# Altium project QSTL_RFSW_LED.PrjPcb
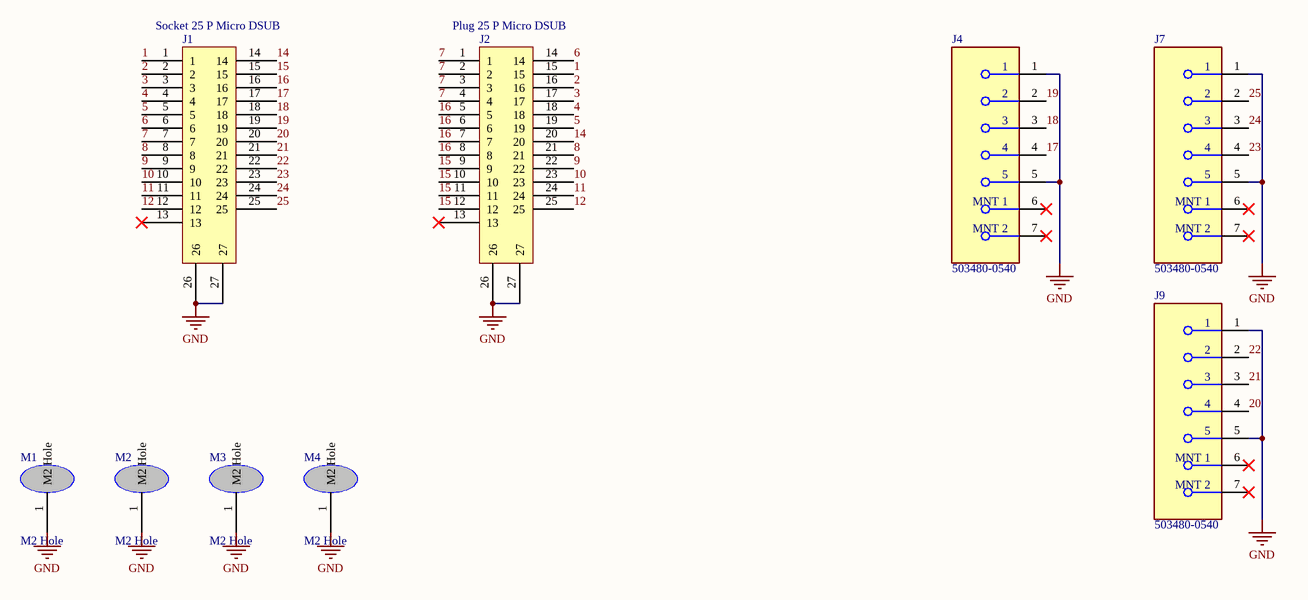
[diagram p0: QSTL_RFSW_LED.SchDoc]
1 sheet, 9 parts. Net scope: global (net labels, ports and power ports of the same name join across sheets).
Board file: QSTL_RFSW_LED.PcbDoc

## Sheet QSTL_RFSW_LED.SchDoc
size A4; SheetNumber: 1; SheetTotal: 1

### Parts
J1  Socket 25 P Micro DSUB  [581-M25-213L461]
J2  Plug 25 P Micro DSUB  [581-M25-113L461]
J4  503480-0540  [FP-503480-0540-MFG]
J7  503480-0540  [FP-503480-0540-MFG]
J9  503480-0540  [FP-503480-0540-MFG]
M1  M2 Hole  [M2_Hole]
M2  M2 Hole  [M2_Hole]
M3  M2 Hole  [M2_Hole]
M4  M2 Hole  [M2_Hole]

### Nets
GND: J1.26 J1.27 J2.26 J2.27 J4.1 J4.5 J7.1 J7.5 J9.1 J9.5 M1.1(M2_Hole) M2.1(M2_Hole) M3.1(M2_Hole) M4.1(M2_Hole)
1: J1.1 J2.15
2: J1.2 J2.16
3: J1.3 J2.17
4: J1.4 J2.18
5: J1.5 J2.19
6: J1.6 J2.14
7: J1.7 J2.1 J2.2 J2.3 J2.4
8: J1.8 J2.21
9: J1.9 J2.22
10: J1.10 J2.23
11: J1.11 J2.24
12: J1.12 J2.25
14: J1.14 J2.20
15: J1.15 J2.9 J2.10 J2.11 J2.12
16: J1.16 J2.5 J2.6 J2.7 J2.8
17: J1.17 J4.4
18: J1.18 J4.3
19: J1.19 J4.2
20: J1.20 J9.4
21: J1.21 J9.3
22: J1.22 J9.2
23: J1.23 J7.4
24: J1.24 J7.3
25: J1.25 J7.2

Not connected (* = marked no-connect by the designer): J1 13*; J2 13*; J4 6(MNT_1)* 7(MNT_2)*; J7 6(MNT_1)* 7(MNT_2)*; J9 6(MNT_1)* 7(MNT_2)*

### Library data of the parts
J1 = 581-M25-213L461
J2 = 581-M25-113L461
J4 J7 J9 = CMP-00257-52963780-1: 503480-0540 Connector FFC/FPC SKT 5 Position 0.5mm Solder Right Angle Surface Mount T/R; Manufacturer Lifecycle Status: ACTIVE; Actuator Material: Glass, Nylon, Polyamide; Number of Positions: 5; Pitch: 508µm; Plating: Gold; Voltage Rating: 50V; Current Rating: 500mA; Wire/Cable Type: Straight; Contact Plating: Gold; Termination: Solder; Country of Origin: KR; Number of Rows: 1; RoHS: Compliant; NexarPartId: 52963780; Max Operating Temperature: 85°C; Lifecycle Status: Production; Mount: Surface Mount; Halogen Free: Low Halogen; Height: 2.07mm; Housing Material: Polymer; Number of Circuits: 5; Number of Contacts: 5; Min Operating Temperature: -40°C; Flammability Rating: UL94 V-0; Contact Material: Bronze, Gold, Nickel; Orientation: Right Angle
M1-M4 = M2_HOLE